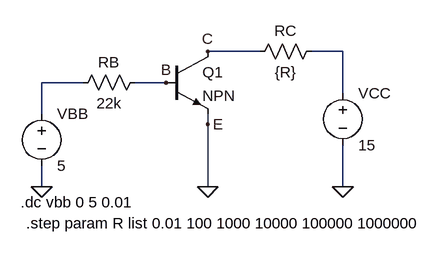
[diagram p0: schematic Draft2.asc]
Draft2.asc, the LTspice schematic file:
Version 4
SHEET 1 880 680
WIRE 336 80 256 80
WIRE 464 80 416 80
WIRE 64 128 0 128
WIRE 192 128 144 128
WIRE 464 144 464 80
WIRE 0 176 0 128
WIRE 256 192 256 176
WIRE 0 288 0 256
WIRE 256 288 256 192
WIRE 464 288 464 224
FLAG 0 288 0
FLAG 464 288 0
FLAG 256 288 0
FLAG 192 128 B
FLAG 256 80 C
FLAG 256 192 E
SYMBOL voltage 0 160 R0
SYMATTR InstName VBB
SYMATTR Value 5
SYMBOL voltage 464 128 R0
SYMATTR InstName VCC
SYMATTR Value 15
SYMBOL res 160 112 R90
WINDOW 0 0 56 VBottom 2
WINDOW 3 32 56 VTop 2
SYMATTR InstName RB
SYMATTR Value 22k
SYMBOL res 432 64 R90
WINDOW 0 0 56 VBottom 2
WINDOW 3 32 56 VTop 2
SYMATTR InstName RC
SYMATTR Value {R}
SYMBOL npn 192 80 R0
SYMATTR InstName Q1
TEXT -32 312 Left 2 !.dc vbb 0 5 0.01
TEXT -24 344 Left 2 !.step param R list 0.01 100 1000 10000 100000 1000000

The netlist it stands for:
* Draft2.asc
VBB N002 0 5
VCC N001 0 15
RB B N002 22k
RC N001 C {R}
Q1 C B 0 0 NPN
.model NPN NPN
.model PNP PNP
.lib standard.bjt
.dc vbb 0 5 0.01
.step param R list 0.01 100 1000 10000 100000 1000000
.backanno
.end

* Results of the author's LTspice run, read from the files saved beside the schematic
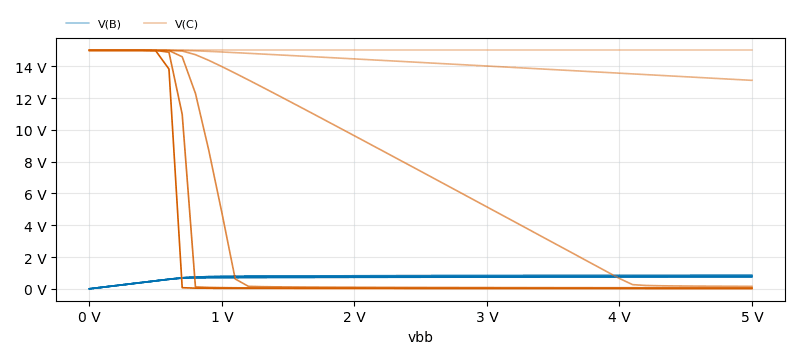
[diagram p1: DC transfer characteristic of Draft2.asc, plotted from the saved traces]
* DC transfer characteristic, 6 runs:
*   V(B) [r=0.01]: 330 nV at vbb=0 V, 850.2 mV at vbb=5 V, min 330 nV, max 850.2 mV
*   V(B) [r=100]: 330 nV at vbb=0 V, 850.2 mV at vbb=5 V, min 330 nV, max 850.2 mV
*   V(B) [r=1000]: 330 nV at vbb=0 V, 844.1 mV at vbb=5 V, min 330 nV, max 844.1 mV
*   V(B) [r=10000]: 330 nV at vbb=0 V, 790 mV at vbb=5 V, min 330 nV, max 790 mV
*   V(B) [r=100000]: 330 nV at vbb=0 V, 757.6 mV at vbb=5 V, min 330 nV, max 757.6 mV
*   V(B) [r=1e+006]: 330 nV at vbb=0 V, 750.1 mV at vbb=5 V, min 330 nV, max 750.1 mV
*   V(C) [r=0.01]: 15 V at vbb=0 V, 15 V at vbb=5 V, min 15 V, max 15 V
*   V(C) [r=100]: 15 V at vbb=0 V, 13.11 V at vbb=5 V, min 13.11 V, max 15 V
*   V(C) [r=1000]: 15 V at vbb=0 V, 153.4 mV at vbb=5 V, min 153.4 mV, max 15 V
*   V(C) [r=10000]: 15 V at vbb=0 V, 61.15 mV at vbb=5 V, min 61.15 mV, max 15 V
*   V(C) [r=100000]: 15 V at vbb=0 V, 26.61 mV at vbb=5 V, min 26.61 mV, max 15 V
*   V(C) [r=1e+006]: 15 V at vbb=0 V, 18.93 mV at vbb=5 V, min 18.93 mV, max 15 V